# Altium schematic sheet can.SchDoc
size A
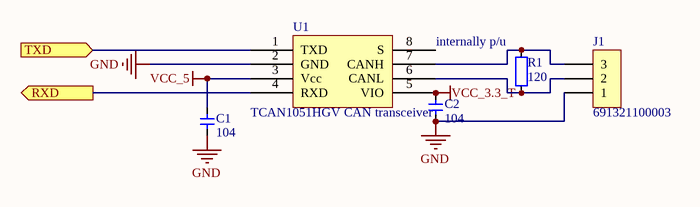
[diagram p0: can.SchDoc]

## Parts
C1  value 104  [CAP_0603]  (hidden comment: Cap_0603)
C2  value 104  [CAP_0603]  (hidden comment: Cap_0603)
J1  691321100003  [691322110003]
R1  value 120  [RES_0603]  (hidden comment: Res_0603)
U1  TCAN1051HGV CAN transceiver  [SOIC127P600X175-8N]

## Ports
RXD (out), TXD (in)

## Nets
GND: C1.1 C2.1 J1.1 U1.2(GND)
VCC_3.3_T: C2.2 U1.5(VIO)
VCC_5: C1.2 U1.3(Vcc)
RXD: U1.4(RXD) ; port RXD
TXD: U1.1(TXD) ; port TXD
NetJ1_2: J1.2 R1.1 U1.6(CANL)
NetJ1_3: J1.3 R1.2 U1.7(CANH)

Not connected (* = marked no-connect by the designer): U1 8(S)

## Notes on the sheet
- (near R1) internally p/u

## Library data of the parts
C1 C2 = Cap_0603: Capacitor
J1 = 691321100003: WR-TBL Terminal block - serie 3211 - 3.50 mm; Manufacturer: Würth Elektronik eiSos GmbH; ComponentLink1 Description: Manufacturer; ComponentLink2 Description: Datasheet; NoPins: 3; Created Date: 9 December 2013; partNo: 691321100003; ComponentLink1URL: http://www.we-online.com; ComponentLink2URL: http://katalog.we-online.de/em/datasheet/6913211000xx.pdf; Created by: Karrer Zheng
R1 = Res_0603: Resistor
U1 = TCAN1051HGV